# Altium project AudioBox_Amp.PrjPcb
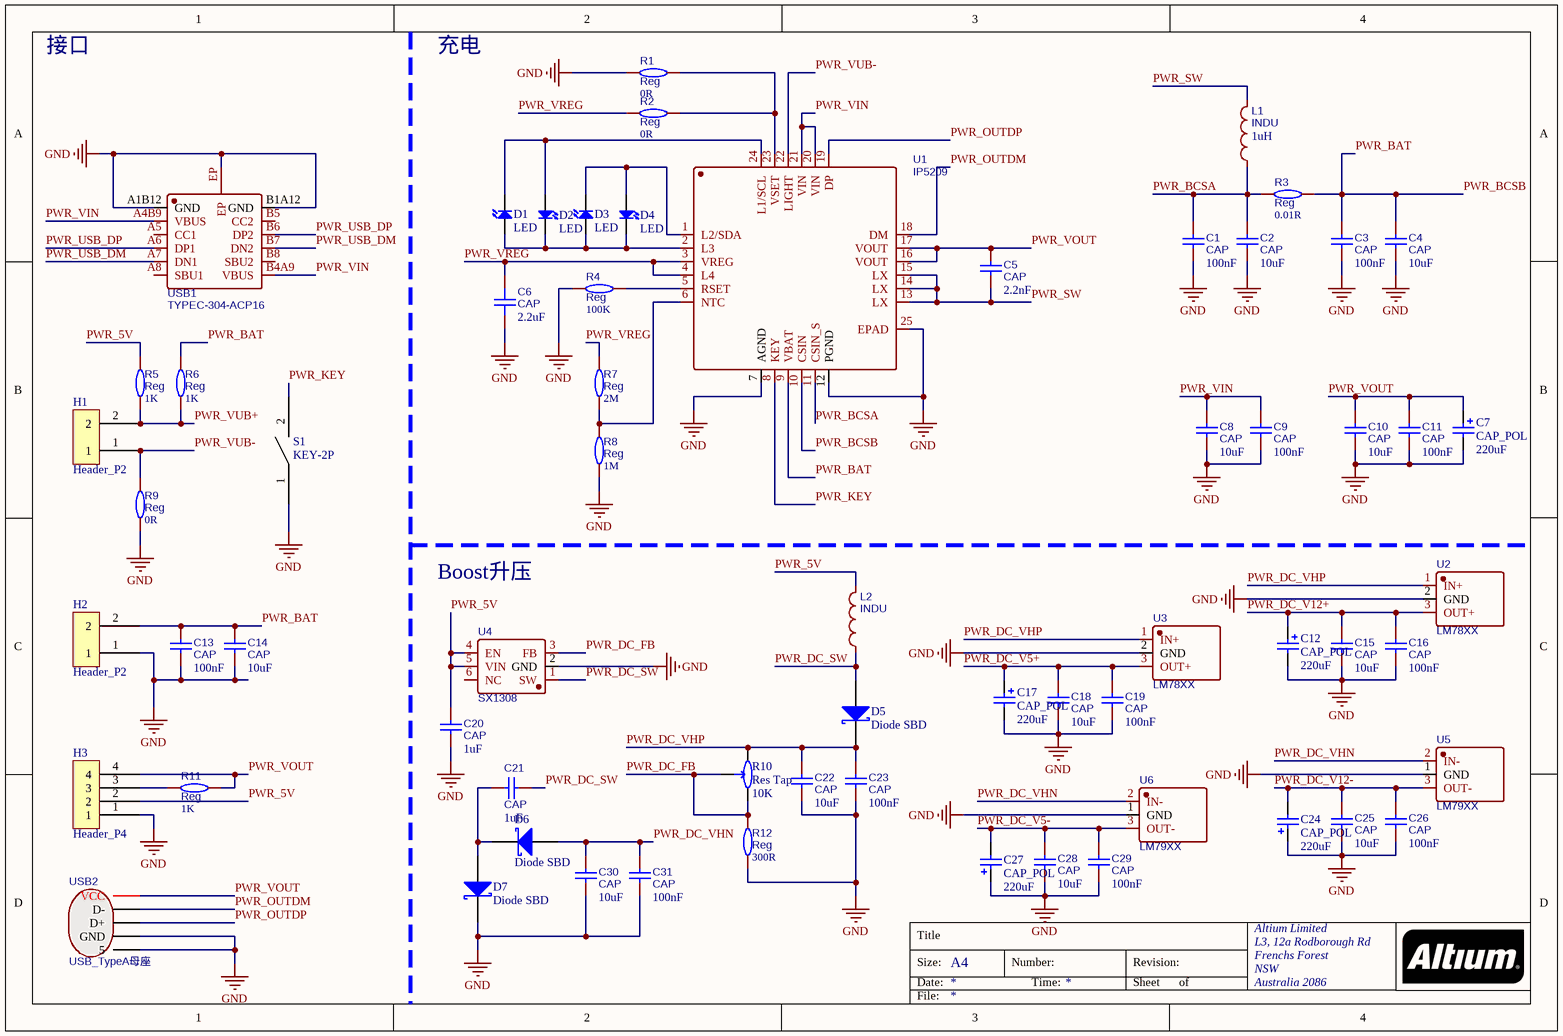
[diagram p0: Power.SchDoc]
5 sheets, 196 parts. Net scope: global (net labels, ports and power ports of the same name join across sheets).
Board file: AudioBoxV2.PcbDoc
Sheets:
  Power.SchDoc
  Audio.SchDoc
  VU_LED.SchDoc
  FrontPanel.SchDoc
  SidePanel.SchDoc

## Sheet Power.SchDoc
size A4; Organization: Altium Limited; Address1: L3, 12a Rodborough Rd; Address2: Frenchs Forest; Address3: NSW; Address4: Australia 2086

### Parts
C1  CAP  value 100nF  [C0603]
C2  CAP  value 10uF  [C0603]
C3  CAP  value 100nF  [C0603]
C4  CAP  value 10uF  [C0603]
C5  CAP  value 2.2nF  [C0603]
C6  CAP  value 2.2uF  [C0603]
C7  CAP_POL  value 220uF  [CAP_SMD_6.3mm]
C8  CAP  value 10uF  [C0603]
C9  CAP  value 100nF  [C0603]
C10  CAP  value 10uF  [C0603]
C11  CAP  value 100nF  [C0603]
C12  CAP_POL  value 220uF  [CAP_SMD_6.3mm]
C13  CAP  value 100nF  [C0603]
C14  CAP  value 10uF  [C0603]
C15  CAP  value 10uF  [C0603]
C16  CAP  value 100nF  [C0603]
C17  CAP_POL  value 220uF  [CAP_SMD_6.3mm]
C18  CAP  value 10uF  [C0603]
C19  CAP  value 100nF  [C0603]
C20  CAP  value 1uF  [C0603]
C21  CAP  value 1uF  [C0603]
C22  CAP  value 10uF  [C0603]
C23  CAP  value 100nF  [C0603]
C24  CAP_POL  value 220uF  [CAP_SMD_6.3mm]
C25  CAP  value 10uF  [C0603]
C26  CAP  value 100nF  [C0603]
C27  CAP_POL  value 220uF  [CAP_SMD_6.3mm]
C28  CAP  value 10uF  [C0603]
C29  CAP  value 100nF  [C0603]
C30  CAP  value 10uF  [C0603]
C31  CAP  value 100nF  [C0603]
D1  LED  [LED0603_Side]
D2  LED  [LED0603_Side]
D3  LED  [LED0603_Side]
D4  LED  [LED0603_Side]
D5  Diode SBD  [SMA_L4.3]
D6  Diode SBD  [SMA_L4.3]
D7  Diode SBD  [SMA_L4.3]
H1  Header_P2  [H_2.54_P2]
H2  Header_P2  [H_2.54_P2]
H3  Header_P4  [H_2.54_P4]
L1  INDU  value 1uH  [SMD_L7.1]
L2  INDU  [SMD_L7.1]
R1  Reg  value 0R  [R0603]
R2  Reg  value 0R  [R0603]
R3  Reg  value 0.01R  [R1206]
R4  Reg  value 100K  [R0603]
R5  Reg  value 1K  [R0603]
R6  Reg  value 1K  [R0603]
R7  Reg  value 2M  [R0603]
R8  Reg  value 1M  [R0603]
R9  Reg  value 0R  [R0603]
R10  Res Tap  value 10K  [RES_TAP_HOR]
R11  Reg  value 1K  [R0603]
R12  Reg  value 300R  [R0603]
S1  KEY-2P  [KEY_SOT_P2]
U1  IP5209  [QFN-24]
U2  LM78XX  [TO-220-3_2.54_HOR]
U3  LM78XX  [TO-220-3_2.54_HOR]
U4  SX1308  [SOT-23-6]
U5  LM79XX  [TO-220-3_2.54_HOR]
U6  LM79XX  [TO-220-3_2.54_HOR]
USB1  TYPEC-304-ACP16  [USB-C-SMD_TYPE-C-16P]
USB2  USB_TypeA母座  [USB_TYPEA-SMD]

### Nets
GND: C1.2 C2.2 C3.2 C4.2 C6.2 C7.2 C8.2 C9.2 C10.2 C11.2 C12.2 C13.2 C14.2 C15.2 C16.2 C17.2 C18.2 C19.2 C20.2 C22.2 C23.2 C24.1 C25.2 C26.2 C27.1 C28.2 C29.2 C30.2 C31.2 D7.1(K) H2.1 H3.1 R1.2 R4.2 R8.2 R9.1 R12.1 S1.1 U1.7(AGND) U1.12(PGND) U1.25(EPAD) U2.2(GND) U3.2(GND) U4.2(GND) U5.1(GND) U6.1(GND) USB1.A1B12(GND) USB1.B1A12(GND) USB1.EP USB2.4(GND) USB2.5
PWR_5V: C20.1 H3.2 L2.2 R5.2 U4.4(EN) U4.5(VIN)
PWR_BAT: C3.1 C4.1 C13.1 C14.1 H2.2 R3.2 R6.2 U1.9(VBAT) U1.10(CSIN)  [also labelled PWR_BCSB]
PWR_BCSA: C1.1 C2.1 L1.1 R3.1 U1.11(CSIN_S)
PWR_DC_FB: R10.1(A) R10.3(TAP) R12.2 U4.3(FB)
PWR_DC_SW: C21.1 D5.2(A) L2.1 U4.1(SW)
PWR_DC_V5+: C17.1 C18.1 C19.1 U3.3(OUT+)
PWR_DC_V5-: C27.2 C28.1 C29.1 U6.3(OUT-)
PWR_DC_V12+: C12.1 C15.1 C16.1 U2.3(OUT+)  [project net A_VLB12V+]
PWR_DC_V12-: C24.2 C25.1 C26.1 U5.3(OUT-)  [project net A_VLB12V-]
PWR_DC_VHN: C30.1 C31.1 D6.2(A) U5.2(IN-) U6.2(IN-)
PWR_DC_VHP: C22.1 C23.1 D5.1(K) R10.2(B) U2.1(IN+) U3.1(IN+)
PWR_KEY: S1.2 U1.8(KEY)
PWR_OUTDM: U1.18(DM) USB2.2(D-)
PWR_OUTDP: U1.19(DP) USB2.3(D+)
PWR_SW: C5.2 L1.2 U1.13(LX) U1.14(LX) U1.15(LX)
PWR_USB_DM: USB1.A7(DN1) USB1.B7(DN2)
PWR_USB_DP: USB1.A6(DP1) USB1.B6(DP2)
PWR_VIN: C8.1 C9.1 U1.20(VIN) U1.21(VIN) USB1.A4B9(VBUS) USB1.B4A9(VBUS)
PWR_VOUT: C5.1 C7.1 C10.1 C11.1 H3.4 R11.1 U1.16(VOUT) U1.17(VOUT) USB2.1(VCC)
PWR_VREG: C6.1 R2.2 R7.1 U1.3(VREG) U1.4(L4)
PWR_VUB+: H1.2 R5.1 R6.1
PWR_VUB-: H1.1 R9.2 U1.22(LIGHT)
NetC21_2: C21.2 D6.1(K) D7.2(A)
NetD1_1: D1.1(K) D2.2(A) U1.24(L1/SCL)
NetD1_2: D1.2(A) D2.1(K) D3.2(A) D4.1(K) U1.2(L3)
NetD3_1: D3.1(K) D4.2(A) U1.1(L2/SDA)
NetH3_3: H3.3 R11.2
NetR1_1: R1.1 R2.1 U1.23(VSET)
NetR4_1: R4.1 U1.5(RSET)
NetR7_2: R7.2 R8.1 U1.6(NTC)

Not connected (* = marked no-connect by the designer): U4 6(NC); USB1 A5(CC1) A8(SBU1) B5(CC2) B8(SBU2)

### Notes on the sheet
- 接口
- 充电
- Boost升压
- Title
- Size:
- Date:
- A4
- Number:
- Time:
- Revision:
- Sheet
- of
- File:

### Library data of the parts
C1-C6 C8-C11 C13-C16 C18-C23 C25 C26 C28-C31 = CAP: BOM_Manufacturer: Huaxin S&T; BOM_Manufacturer Part: 0603B103K101CT; nameAlias: Capacitance; Contributor: LCSC; BOM_Supplier: LCSC; BOM_Supplier Part: C302008; spicePre: C; spiceSymbolName: 0603B103K101CT
C7 C12 C17 C24 C27 = CAP_POL: 极性电容
D1-D4 = LED0: Published: 8-Jun-2000; LatestRevisionDate: 08-Jul-2005; LatestRevisionNote: Mech Layer 1 removed.; PackageReference: LED-0; Publisher: Altium Limited; PackageDescription: LED; 2 Leads
D5-D7 = Diode SBD: Schottky Rectifier; Note: Terminal 2 is the TAB and is electrically connected to the cathode; Published: 8-Jun-2000; LatestRevisionDate: 17-Jul-2002; LatestRevisionNote: Re-released for DXP Platform.; DatasheetVersion: PD-2.057B; PackageVersion: Feb-1998; PackageReference: TO-220AC; Publisher: Altium Limited; PackageDescription: TO, Thru-Hole, Vertical, Heatsink Mounted; 3 In-Line Leads (1 Absent); Pitch 2.54 mm; ComponentLink1Description: Manufacturer Link; ComponentLink1URL: http://www.irf.com/; ComponentLink2Description: Datasheet; ComponentLink2URL: http://www.irf.com/product-info/datasheets/data/10tq.pdf
H1 H2 = Header_P2: 2Pin排针
H3 = Header_P4: 4Pin排针
L1 L2 = IND: 电感; BOM_Manufacturer: Sunltech Tech; BOM_Manufacturer Part: SLO0630H150MTT; nameAlias: Inductance; Contributor: LCSC; BOM_Supplier: LCSC; BOM_Supplier Part: C182182; BOM_JLCPCB Part Class: Extended Part; spicePre: L; spiceSymbolName: SLO0630H150MTT
  L2: Value: *
R1-R9 R11 R12 = Res: 电阻; BOM_Manufacturer: Viking Tech; BOM_Manufacturer Part: AR03BTCX1002A; nameAlias: Resistance (Ohms); Contributor: LCSC; BOM_Supplier: LCSC; BOM_Supplier Part: C465721; spicePre: R; spiceSymbolName: AR03BTCX1002A
R10 = Res Tap: 可调电阻; Sim Note: Enter the Resistance value and the set point into parameter fields.; Set Position: 0.5; Published: 24-Mar-1999; LatestRevisionDate: 17-Jul-2002; LatestRevisionNote: Re-released for DXP Platform.; PackageReference: VR3; Publisher: Altium Limited; PackageDescription: Variable Resistor, Thru-Hole; 3 Leads
S1 = KEY_2P: KEY-2Pp
U1 = IP5209: USB充电宝; BOM_Manufacturer: INJOINIC; Contributor: LCSC; BOM_Supplier: LCSC; BOM_Supplier Part: C181695; BOM_Manufacturer Part: IP5209; BOM_JLCPCB Part Class: Extended Part; spicePre: U; spiceSymbolName: IP5209
U2 U3 = LM78XX: 三端稳压(正电压); BOM_Manufacturer: HGSEMI(华冠); BOM_Manufacturer Part: LM7812T; Contributor: LCSC; BOM_Supplier: LCSC; BOM_Supplier Part: C2902509; BOM_JLCPCB Part Class: Extended Part; spicePre: U; spiceSymbolName: LM7812T
U4 = SX1308: 升压PWM; BOM_Manufacturer: SX; sourceId: g4Yg9rJ1j; timeStamp: 1472247539; BOM_Supplier: LCSC; BOM_Manufacturer Part: SX1308; BOM_Supplier Part: C78162; BOM_JLCPCB Part Class: Extended Part; spicePre: U; spiceSymbolName: SX1308
U5 U6 = LM79XX: 三端稳压(负电压); BOM_Manufacturer: HGSEMI(华冠); BOM_Manufacturer Part: LM7812T; Contributor: LCSC; BOM_Supplier: LCSC; BOM_Supplier Part: C2902509; BOM_JLCPCB Part Class: Extended Part; spicePre: U; spiceSymbolName: LM7812T
USB1 = USB_TYPEC_12P: 全引脚USB TYPEC母座; BOM_Manufacturer: XUNPU(讯普); Contributor: LCSC; BOM_Supplier: LCSC; BOM_Supplier Part: C2982555; BOM_Manufacturer Part: TYPEC-304-ACP16; BOM_JLCPCB Part Class: Extended Part; spicePre: U; spiceSymbolName: TYPEC-304-ACP16
USB2 = USB-TYPEA: BOM_Manufacturer: ValuePro; BOM_Manufacturer Part: YJ-USB-AF-SMT-01; BOM_Supplier: LCSC; BOM_Supplier Part: C8328; BOM_JLCPCB Part Class: Extended Part; spicePre: U; spiceSymbolName: YJ-USB-AF-SMT-01

## Sheet Audio.SchDoc
size A4; Organization: Altium Limited; Address1: L3, 12a Rodborough Rd; Address2: Frenchs Forest; Address3: NSW; Address4: Australia 2086
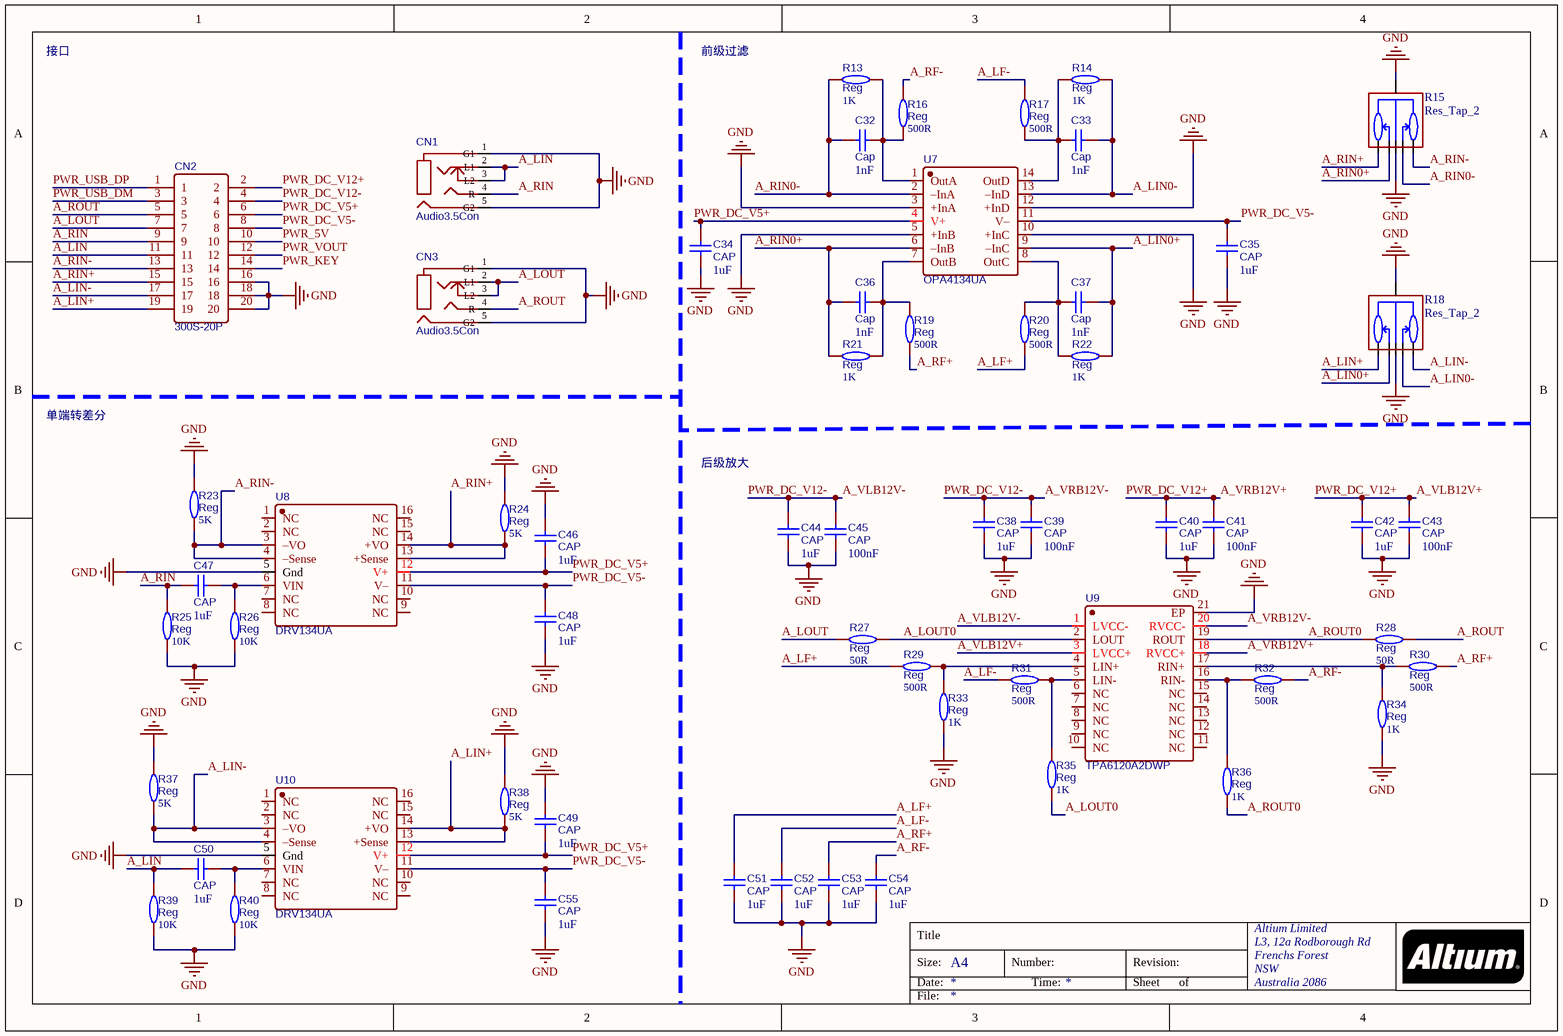
[diagram p1: Audio.SchDoc]

### Parts
C32  Cap  value 1nF  [C0603]
C33  Cap  value 1nF  [C0603]
C34  CAP  value 1uF  [C0603]
C35  CAP  value 1uF  [C0603]
C36  Cap  value 1nF  [C0603]
C37  Cap  value 1nF  [C0603]
C38  CAP  value 1uF  [C0603]
C39  CAP  value 100nF  [C0603]
C40  CAP  value 1uF  [C0603]
C41  CAP  value 100nF  [C0603]
C42  CAP  value 1uF  [C0603]
C43  CAP  value 100nF  [C0603]
C44  CAP  value 1uF  [C0603]
C45  CAP  value 100nF  [C0603]
C46  CAP  value 1uF  [C0603]
C47  CAP  value 1uF  [C0603]
C48  CAP  value 1uF  [C0603]
C49  CAP  value 1uF  [C0603]
C50  CAP  value 1uF  [C0603]
C51  CAP  value 1uF  [C0603]
C52  CAP  value 1uF  [C0603]
C53  CAP  value 1uF  [C0603]
C54  CAP  value 1uF  [C0603]
C55  CAP  value 1uF  [C0603]
CN1  Audio3.5Con  [Audio3.5_3Pin]
CN2  300S-20P  [DC_20P_2.54]
CN3  Audio3.5Con  [Audio3.5_3Pin]
R13  Reg  value 1K  [R0603]
R14  Reg  value 1K  [R0603]
R15  Res_Tap_2  [RES_TAP_5Pin]
R16  Reg  value 500R  [R0603]
R17  Reg  value 500R  [R0603]
R18  Res_Tap_2  [RES_TAP_5Pin]
R19  Reg  value 500R  [R0603]
R20  Reg  value 500R  [R0603]
R21  Reg  value 1K  [R0603]
R22  Reg  value 1K  [R0603]
R23  Reg  value 5K  [R0603]
R24  Reg  value 5K  [R0603]
R25  Reg  value 10K  [R0603]
R26  Reg  value 10K  [R0603]
R27  Reg  value 50R  [R0603]
R28  Reg  value 50R  [R0603]
R29  Reg  value 500R  [R0603]
R30  Reg  value 500R  [R0603]
R31  Reg  value 500R  [R0603]
R32  Reg  value 500R  [R0603]
R33  Reg  value 1K  [R0603]
R34  Reg  value 1K  [R0603]
R35  Reg  value 1K  [R0603]
R36  Reg  value 1K  [R0603]
R37  Reg  value 5K  [R0603]
R38  Reg  value 5K  [R0603]
R39  Reg  value 10K  [R0603]
R40  Reg  value 10K  [R0603]
U7  OPA4134UA  [SOIC-16_5.4mm]
U8  DRV134UA  [SOIC-16_9.5mm]
U9  TPA6120A2DWP  [HSOP-20]
U10  DRV134UA  [SOIC-16_9.5mm]

### Nets
GND: C34.1 C35.1 C38.1 C39.1 C40.1 C41.1 C42.1 C43.1 C44.1 C45.1 C46.2 C48.1 C49.2 C51.2 C52.2 C53.2 C54.2 C55.1 CN1.1(G1) CN1.5(G2) CN2.16 CN2.18 CN2.20 CN3.1(G1) CN3.5(G2) R15.1(G) R15.6(PAD) R18.1(G) R18.6(PAD) R23.2 R24.1 R25.1 R26.1 R33.1 R34.1 R37.2 R38.1 R39.1 R40.1 U7.3(+InA) U7.5(+InB) U7.10(+InC) U7.12(+InD) U8.5(Gnd) U9.21(EP) U10.5(Gnd)
A_LF+: C51.1 R20.1 R29.1
A_LF-: C52.1 R17.2 R31.1
A_LIN: C50.1 CN1.2(L1) CN1.3(L2) CN2.11 R39.2
A_LIN0+: C37.2 R18.3(CH2A) R22.2 U7.9(–InC)
A_LIN0-: C33.2 R14.2 R18.2(CH1A) U7.13(–InD)
A_LIN+: CN2.19 R18.4(CH2B) R38.2 U10.13(+Sense) U10.14(+VO)
A_LIN-: CN2.17 R18.5(CH1B) R37.1 U10.3(–VO) U10.4(–Sense)
A_LOUT: CN2.7 CN3.2(L1) CN3.3(L2) R27.1
A_LOUT0: R27.2 R35.1 U9.2(LOUT)
A_RF+: C53.1 R19.1 R30.1
A_RF-: C54.1 R16.2 R32.1
A_RIN: C47.1 CN1.4(R) CN2.9 R25.2
A_RIN0+: C36.1 R15.3(CH2A) R21.1 U7.6(–InB)
A_RIN0-: C32.1 R13.1 R15.2(CH1A) U7.2(–InA)
A_RIN+: CN2.15 R15.4(CH2B) R24.2 U8.13(+Sense) U8.14(+VO)
A_RIN-: CN2.13 R15.5(CH1B) R23.1 U8.3(–VO) U8.4(–Sense)
A_ROUT: CN2.5 CN3.4(R) R28.2
A_ROUT0: R28.1 R36.1 U9.19(ROUT)
A_VLB12V+: C40.2 C41.2 C42.2 C43.2 CN2.2 U9.3(LVCC+) U9.18(RVCC+)  [also labelled A_VRB12V+, PWR_DC_V12+]
A_VLB12V-: C38.2 C39.2 C44.2 C45.2 CN2.4 U9.1(LVCC-) U9.20(RVCC-)  [also labelled A_VRB12V-, PWR_DC_V12-]
PWR_5V: CN2.10
PWR_DC_V5+: C34.2 C46.1 C49.1 CN2.6 U7.4(V+) U8.12(V+) U10.12(V+)
PWR_DC_V5-: C35.2 C48.2 C55.2 CN2.8 U7.11(V–) U8.11(V–) U10.11(V–)
PWR_KEY: CN2.14
PWR_USB_DM: CN2.3
PWR_USB_DP: CN2.1
PWR_VOUT: CN2.12
NetC32_2: C32.2 R13.2 R16.1 U7.1(OutA)
NetC33_1: C33.1 R14.1 R17.1 U7.14(OutD)
NetC36_2: C36.2 R19.2 R21.2 U7.7(OutB)
NetC37_1: C37.1 R20.2 R22.1 U7.8(OutC)
NetC47_2: C47.2 R26.2 U8.6(VIN)
NetC50_2: C50.2 R40.2 U10.6(VIN)
NetR29_2: R29.2 R33.2 U9.4(LIN+)
NetR30_2: R30.2 R34.2 U9.17(RIN+)
NetR31_2: R31.2 R35.2 U9.5(LIN-)
NetR32_2: R32.2 R36.2 U9.16(RIN-)

Not connected (* = marked no-connect by the designer): U8 1(NC) 2(NC) 7(NC) 8(NC) 9(NC) 10(NC) 15(NC) 16(NC); U9 6(NC) 7(NC) 8(NC) 9(NC) 10(NC) 11(NC) 12(NC) 13(NC) 14(NC) 15(NC); U10 1(NC) 2(NC) 7(NC) 8(NC) 9(NC) 10(NC) 15(NC) 16(NC)

### Notes on the sheet
- 接口
- 前级过滤
- 单端转差分
- 后级放大
- Title
- Size:
- Date:
- A4
- Number:
- Time:
- Revision:
- Sheet
- of
- File:

### Library data of the parts
C32-C55 = CAP: as C1 on sheet Power; BOM_Supplier: LCSC; BOM_Supplier Part: C302008; spicePre: C; spiceSymbolName: 0603B103K101CT
CN1 CN3 = AudioCon3: 3.5mm 3Pin 音频接口; BOM_Manufacturer: G-Switch(品赞); BOM_Manufacturer Part: PJ-393; Contributor: LCSC; BOM_Supplier: LCSC; BOM_Supplier Part: C2837065; BOM_JLCPCB Part Class: Extended Part; spicePre: C; spiceSymbolName: PJ-393_C2837065
CN2 = DC-20P: DC牛角座，20P; BOM_Manufacturer: Shenzhen Cankemeng; Contributor: LCSC; BOM_Supplier: LCSC; BOM_Supplier Part: C132442; BOM_Manufacturer Part: -; BOM_JLCPCB Part Class: Extended Part; spicePre: C; spiceSymbolName: 300S-20P
R13 R14 R16 R17 R19-R40 = Res: as R1 on sheet Power; BOM_Supplier: LCSC; BOM_Supplier Part: C465721; spicePre: R; spiceSymbolName: AR03BTCX1002A
R15 R18 = Res_Tap_2: 双联电位器
U7 = OPA4134UA: 耳放; BOM_Manufacturer: TI(德州仪器); Contributor: LCSC; BOM_Supplier: LCSC; BOM_Supplier Part: C2832240; BOM_Manufacturer Part: OPA4134UA; BOM_JLCPCB Part Class: Extended Part; spicePre: U; spiceSymbolName: OPA4134UA
U8 U10 = DRV134UA: 音频差分放大器; BOM_Manufacturer: TI(德州仪器); Contributor: LCSC; BOM_Supplier: LCSC; BOM_Supplier Part: C1519988; BOM_Manufacturer Part: DRV134UA; BOM_JLCPCB Part Class: Extended Part; spicePre: U; spiceSymbolName: DRV134UA
U9 = TPA6120: 耳放; BOM_Manufacturer: TI(德州仪器); Contributor: LCSC; BOM_Supplier: LCSC; BOM_Supplier Part: C2871054; BOM_Manufacturer Part: TPA6120A2DWP; link: https://atta.szlcsc.comnull; spicePre: U; spiceSymbolName: TPA6120A2DWP

## Sheet VU_LED.SchDoc
size A4; Organization: Altium Limited; Address1: L3, 12a Rodborough Rd; Address2: Frenchs Forest; Address3: NSW; Address4: Australia 2086
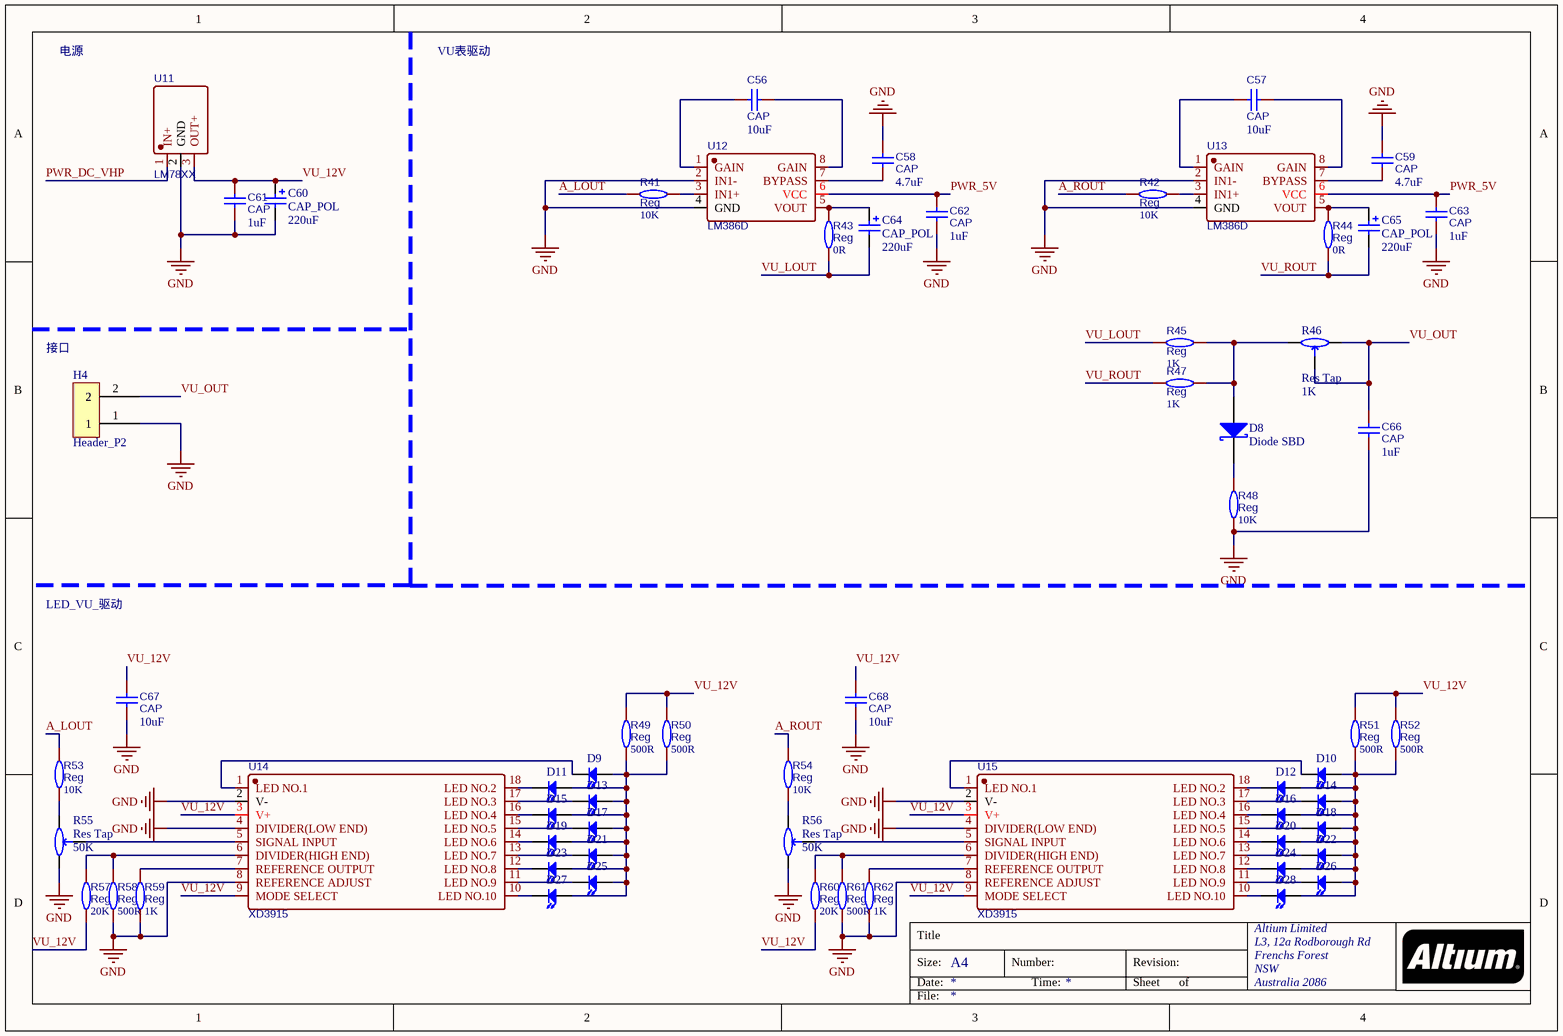
[diagram p2: VU_LED.SchDoc]

### Parts
C56  CAP  value 10uF  [C0603]
C57  CAP  value 10uF  [C0603]
C58  CAP  value 4.7uF  [C0603]
C59  CAP  value 4.7uF  [C0603]
C60  CAP_POL  value 220uF  [CAP_SMD_6.3mm]
C61  CAP  value 1uF  [C0603]
C62  CAP  value 1uF  [C0603]
C63  CAP  value 1uF  [C0603]
C64  CAP_POL  value 220uF  [CAP_SMD_6.3mm]
C65  CAP_POL  value 220uF  [CAP_SMD_6.3mm]
C66  CAP  value 1uF  [C0603]
C67  CAP  value 10uF  [C0603]
C68  CAP  value 10uF  [C0603]
D8  Diode SBD  [SMA_L4.3]
D9  LED  [LED0603_Side]  (value not drawn)
D10  LED  [LED0603_Side]  (value not drawn)
D11  LED  [LED0603_Side]  (value not drawn)
D12  LED  [LED0603_Side]  (value not drawn)
D13  LED  [LED0603_Side]  (value not drawn)
D14  LED  [LED0603_Side]  (value not drawn)
D15  LED  [LED0603_Side]  (value not drawn)
D16  LED  [LED0603_Side]  (value not drawn)
D17  LED  [LED0603_Side]  (value not drawn)
D18  LED  [LED0603_Side]  (value not drawn)
D19  LED  [LED0603_Side]  (value not drawn)
D20  LED  [LED0603_Side]  (value not drawn)
D21  LED  [LED0603_Side]  (value not drawn)
D22  LED  [LED0603_Side]  (value not drawn)
D23  LED  [LED0603_Side]  (value not drawn)
D24  LED  [LED0603_Side]  (value not drawn)
D25  LED  [LED0603_Side]  (value not drawn)
D26  LED  [LED0603_Side]  (value not drawn)
D27  LED  [LED0603_Side]  (value not drawn)
D28  LED  [LED0603_Side]  (value not drawn)
H4  Header_P2  [H_2.54_P2]
R41  Reg  value 10K  [R0603]
R42  Reg  value 10K  [R0603]
R43  Reg  value 0R  [R0603]
R44  Reg  value 0R  [R0603]
R45  Reg  value 1K  [R0603]
R46  Res Tap  value 1K  [RES_TAP_HOR]
R47  Reg  value 1K  [R0603]
R48  Reg  value 10K  [R0603]
R49  Reg  value 500R  [R0603]
R50  Reg  value 500R  [R0603]
R51  Reg  value 500R  [R0603]
R52  Reg  value 500R  [R0603]
R53  Reg  value 10K  [R0603]
R54  Reg  value 10K  [R0603]
R55  Res Tap  value 50K  [RES_TAP_HOR]
R56  Res Tap  value 50K  [RES_TAP_HOR]
R57  Reg  value 20K  [R0603]
R58  Reg  value 500R  [R0603]
R59  Reg  value 1K  [R0603]
R60  Reg  value 20K  [R0603]
R61  Reg  value 500R  [R0603]
R62  Reg  value 1K  [R0603]
U11  LM78XX  [TO-220-3_2.54_HOR]
U12  LM386D  [SOP-8]
U13  LM386D  [SOP-8]
U14  XD3915  [DIP-18]
U15  XD3915  [DIP-18]

### Nets
GND: C58.1 C59.1 C60.2 C61.2 C62.2 C63.2 C66.2 C67.2 C68.2 H4.1 R48.2 R55.2(B) R56.2(B) R58.2 R59.2 R61.2 R62.2 U11.2(GND) U12.2(IN1-) U12.4(GND) U13.2(IN1-) U13.4(GND) U14.2(V-) U14.4(DIVIDER(LOW_END)) U14.8(REFERENCE_ADJUST) U15.2(V-) U15.4(DIVIDER(LOW_END)) U15.8(REFERENCE_ADJUST)
A_LOUT: R41.2 R53.2
A_ROUT: R42.2 R54.2
PWR_5V: C62.1 C63.1 U12.6(VCC) U13.6(VCC)
PWR_DC_VHP: U11.1(IN+)
VU_12V: C60.1 C61.1 C67.1 C68.1 R49.2 R50.2 R51.2 R52.2 R57.2 R60.2 U11.3(OUT+) U14.3(V+) U14.9(MODE_SELECT) U15.3(V+) U15.9(MODE_SELECT)
VU_LOUT: C64.2 R43.2 R45.2
VU_OUT: C66.1 H4.2 R46.1(A) R46.3(TAP)
VU_ROUT: C65.2 R44.2 R47.2
NetC56_1: C56.1 U12.1(GAIN)
NetC56_2: C56.2 U12.8(GAIN)
NetC57_1: C57.1 U13.1(GAIN)
NetC57_2: C57.2 U13.8(GAIN)
NetC58_2: C58.2 U12.7(BYPASS)
NetC59_2: C59.2 U13.7(BYPASS)
NetC64_1: C64.1 R43.1 U12.5(VOUT)
NetC65_1: C65.1 R44.1 U13.5(VOUT)
NetD8_1: D8.1(K) R48.1
NetD8_2: D8.2(A) R45.1 R46.2(B) R47.1
NetD9_1: D9.1(K) U14.1(LED_NO.1)
NetD9_2: D9.2(A) D11.2(A) D13.2(A) D15.2(A) D17.2(A) D19.2(A) D21.2(A) D23.2(A) D25.2(A) D27.2(A) R49.1 R50.1
NetD10_1: D10.1(K) U15.1(LED_NO.1)
NetD10_2: D10.2(A) D12.2(A) D14.2(A) D16.2(A) D18.2(A) D20.2(A) D22.2(A) D24.2(A) D26.2(A) D28.2(A) R51.1 R52.1
NetD11_1: D11.1(K) U14.18(LED_NO.2)
NetD12_1: D12.1(K) U15.18(LED_NO.2)
NetD13_1: D13.1(K) U14.17(LED_NO.3)
NetD14_1: D14.1(K) U15.17(LED_NO.3)
NetD15_1: D15.1(K) U14.16(LED_NO.4)
NetD16_1: D16.1(K) U15.16(LED_NO.4)
NetD17_1: D17.1(K) U14.15(LED_NO.5)
NetD18_1: D18.1(K) U15.15(LED_NO.5)
NetD19_1: D19.1(K) U14.14(LED_NO.6)
NetD20_1: D20.1(K) U15.14(LED_NO.6)
NetD21_1: D21.1(K) U14.13(LED_NO.7)
NetD22_1: D22.1(K) U15.13(LED_NO.7)
NetD23_1: D23.1(K) U14.12(LED_NO.8)
NetD24_1: D24.1(K) U15.12(LED_NO.8)
NetD25_1: D25.1(K) U14.11(LED_NO.9)
NetD26_1: D26.1(K) U15.11(LED_NO.9)
NetD27_1: D27.1(K) U14.10(LED_NO.10)
NetD28_1: D28.1(K) U15.10(LED_NO.10)
NetR41_1: R41.1 U12.3(IN1+)
NetR42_1: R42.1 U13.3(IN1+)
NetR53_1: R53.1 R55.1(A)
NetR54_1: R54.1 R56.1(A)
NetR55_3: R55.3(TAP) U14.5(SIGNAL_INPUT)
NetR56_3: R56.3(TAP) U15.5(SIGNAL_INPUT)
NetR57_1: R57.1 R58.1 U14.6(DIVIDER(HIGH_END))
NetR59_1: R59.1 U14.7(REFERENCE_OUTPUT)
NetR60_1: R60.1 R61.1 U15.6(DIVIDER(HIGH_END))
NetR62_1: R62.1 U15.7(REFERENCE_OUTPUT)

### Notes on the sheet
- 电源
- VU表驱动
- 接口
- LED_VU_驱动
- Title
- Size:
- Date:
- A4
- Number:
- Time:
- Revision:
- Sheet
- of
- File:

### Library data of the parts
C56-C59 C61-C63 C66-C68 = CAP: as C1 on sheet Power; BOM_Supplier: LCSC; BOM_Supplier Part: C302008; spicePre: C; spiceSymbolName: 0603B103K101CT
C60 C64 C65 = CAP_POL: 极性电容
D8 = Diode SBD: as D5 on sheet Power; Published: 8-Jun-2000; LatestRevisionDate: 17-Jul-2002; LatestRevisionNote: Re-released for DXP Platform.; DatasheetVersion: PD-2.057B; PackageVersion: Feb-1998; PackageReference: TO-220AC; Publisher: Altium Limited; PackageDescription: TO, Thru-Hole, Vertical, Heatsink Mounted; 3 In-Line Leads (1 Absent); Pitch 2.54 mm; ComponentLink1Description: Manufacturer Link; ComponentLink1URL: http://www.irf.com/; ComponentLink2Description: Datasheet; ComponentLink2URL: http://www.irf.com/product-info/datasheets/data/10tq.pdf
D9-D28 = LED0: Published: 8-Jun-2000; LatestRevisionDate: 08-Jul-2005; LatestRevisionNote: Mech Layer 1 removed.; PackageReference: LED-0; Publisher: Altium Limited; PackageDescription: LED; 2 Leads
H4 = Header_P2: 2Pin排针
R41-R45 R47-R54 R57-R62 = Res: as R1 on sheet Power; BOM_Supplier: LCSC; BOM_Supplier Part: C465721; spicePre: R; spiceSymbolName: AR03BTCX1002A
R46 R55 R56 = Res Tap: as R10 on sheet Power; Published: 24-Mar-1999; LatestRevisionDate: 17-Jul-2002; LatestRevisionNote: Re-released for DXP Platform.; PackageReference: VR3; Publisher: Altium Limited; PackageDescription: Variable Resistor, Thru-Hole; 3 Leads
U11 = LM78XX: as U2 on sheet Power; BOM_Supplier: LCSC; BOM_Supplier Part: C2902509; BOM_JLCPCB Part Class: Extended Part; spicePre: U; spiceSymbolName: LM7812T
U12 U13 = LM386D: LM386; BOM_Manufacturer: HTC Korea TAEJIN Tech; Contributor: LCSC; BOM_Supplier: LCSC; BOM_Supplier Part: C510560; BOM_Manufacturer Part: LM386D; BOM_JLCPCB Part Class: Extended Part; spicePre: U; spiceSymbolName: LM386D
U14 U15 = LM3915: 电平指示; BOM_Manufacturer: XINLUDA(信路达); Contributor: LCSC; BOM_Supplier: LCSC; BOM_Supplier Part: C609778; BOM_Manufacturer Part: XD3915; BOM_JLCPCB Part Class: Extended Part; Frequency: -; spicePre: U; spiceSymbolName: XD3915

## Sheet FrontPanel.SchDoc
size A4; Organization: Altium Limited; Address1: L3, 12a Rodborough Rd; Address2: Frenchs Forest; Address3: NSW; Address4: Australia 2086
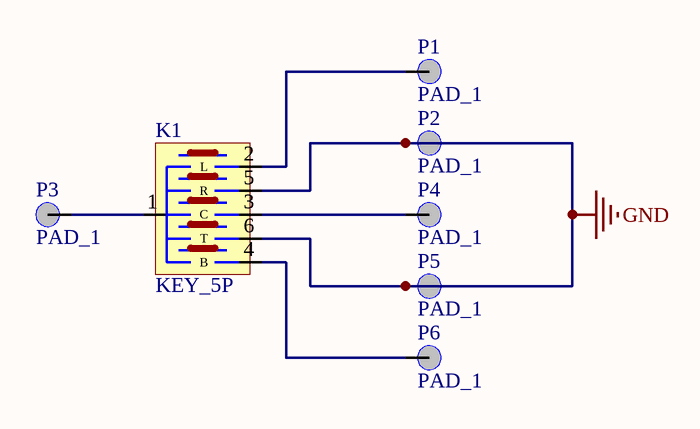
[diagram p3: FrontPanel.SchDoc]

### Parts
K1  KEY_5P  [KEY_5]
P1  PAD_1  [Pad_Slot_1]
P2  PAD_1  [Pad_Pin_1]
P3  PAD_1  [Pad_Slot_1]
P4  PAD_1  [Pad_Slot_1]
P5  PAD_1  [Pad_Pin_1]
P6  PAD_1  [Pad_Slot_1]

### Nets
GND: K1.5(R) K1.6(T) P2.1 P5.1
NetK1_1: K1.1(G) P3.1
NetK1_2: K1.2(L) P1.1
NetK1_3: K1.3(C) P4.1
NetK1_4: K1.4(B) P6.1

### Notes on the sheet
- Title
- Size:
- Date:
- A4
- Number:
- Time:
- Revision:
- Sheet
- of
- File:

### Library data of the parts
K1 = KEY_5P: 五向开关
P1-P6 = PAD_1: 1脚焊盘

## Sheet SidePanel.SchDoc
size A4; Organization: Altium Limited; Address1: L3, 12a Rodborough Rd; Address2: Frenchs Forest; Address3: NSW; Address4: Australia 2086
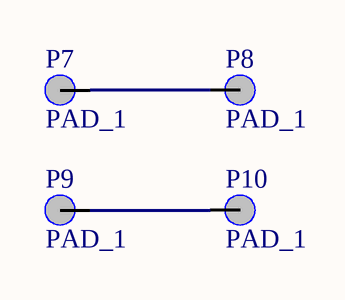
[diagram p4: SidePanel.SchDoc]

### Parts
P7  PAD_1  [Pad_Pin_1]
P8  PAD_1  [Pad_Pin_1]
P9  PAD_1  [Pad_Pin_1]
P10  PAD_1  [Pad_Pin_1]

### Nets
NetP7_1: P7.1 P8.1
NetP9_1: P9.1 P10.1

### Notes on the sheet
- Title
- Size:
- Date:
- A4
- Number:
- Time:
- Revision:
- Sheet
- of
- File:

### Library data of the parts
P7-P10 = PAD_1: 1脚焊盘

## Nets that join several sheets
GND: Power (51 pins), Audio (46 pins), VU_LED (28 pins), FrontPanel (K1.5 K1.6 P2.1 P5.1)
A_LOUT: Audio (CN2.7 CN3.2 CN3.3 R27.1), VU_LED (R41.2 R53.2)
A_ROUT: Audio (CN2.5 CN3.4 R28.2), VU_LED (R42.2 R54.2)
A_VLB12V+: Power (C12.1 C15.1 C16.1 U2.3), Audio (7 pins)
A_VLB12V-: Power (C24.2 C25.1 C26.1 U5.3), Audio (7 pins)
PWR_5V: Power (6 pins), Audio (CN2.10), VU_LED (C62.1 C63.1 U12.6 U13.6)
PWR_DC_V5+: Power (C17.1 C18.1 C19.1 U3.3), Audio (7 pins)
PWR_DC_V5-: Power (C27.2 C28.1 C29.1 U6.3), Audio (7 pins)
PWR_DC_VHP: Power (6 pins), VU_LED (U11.1)
PWR_KEY: Power (S1.2 U1.8), Audio (CN2.14)
PWR_USB_DM: Power (USB1.A7 USB1.B7), Audio (CN2.3)
PWR_USB_DP: Power (USB1.A6 USB1.B6), Audio (CN2.1)
PWR_VOUT: Power (9 pins), Audio (CN2.12)